# EAGLE design PCB-SSB-4x2 (EAGLE 6.4)
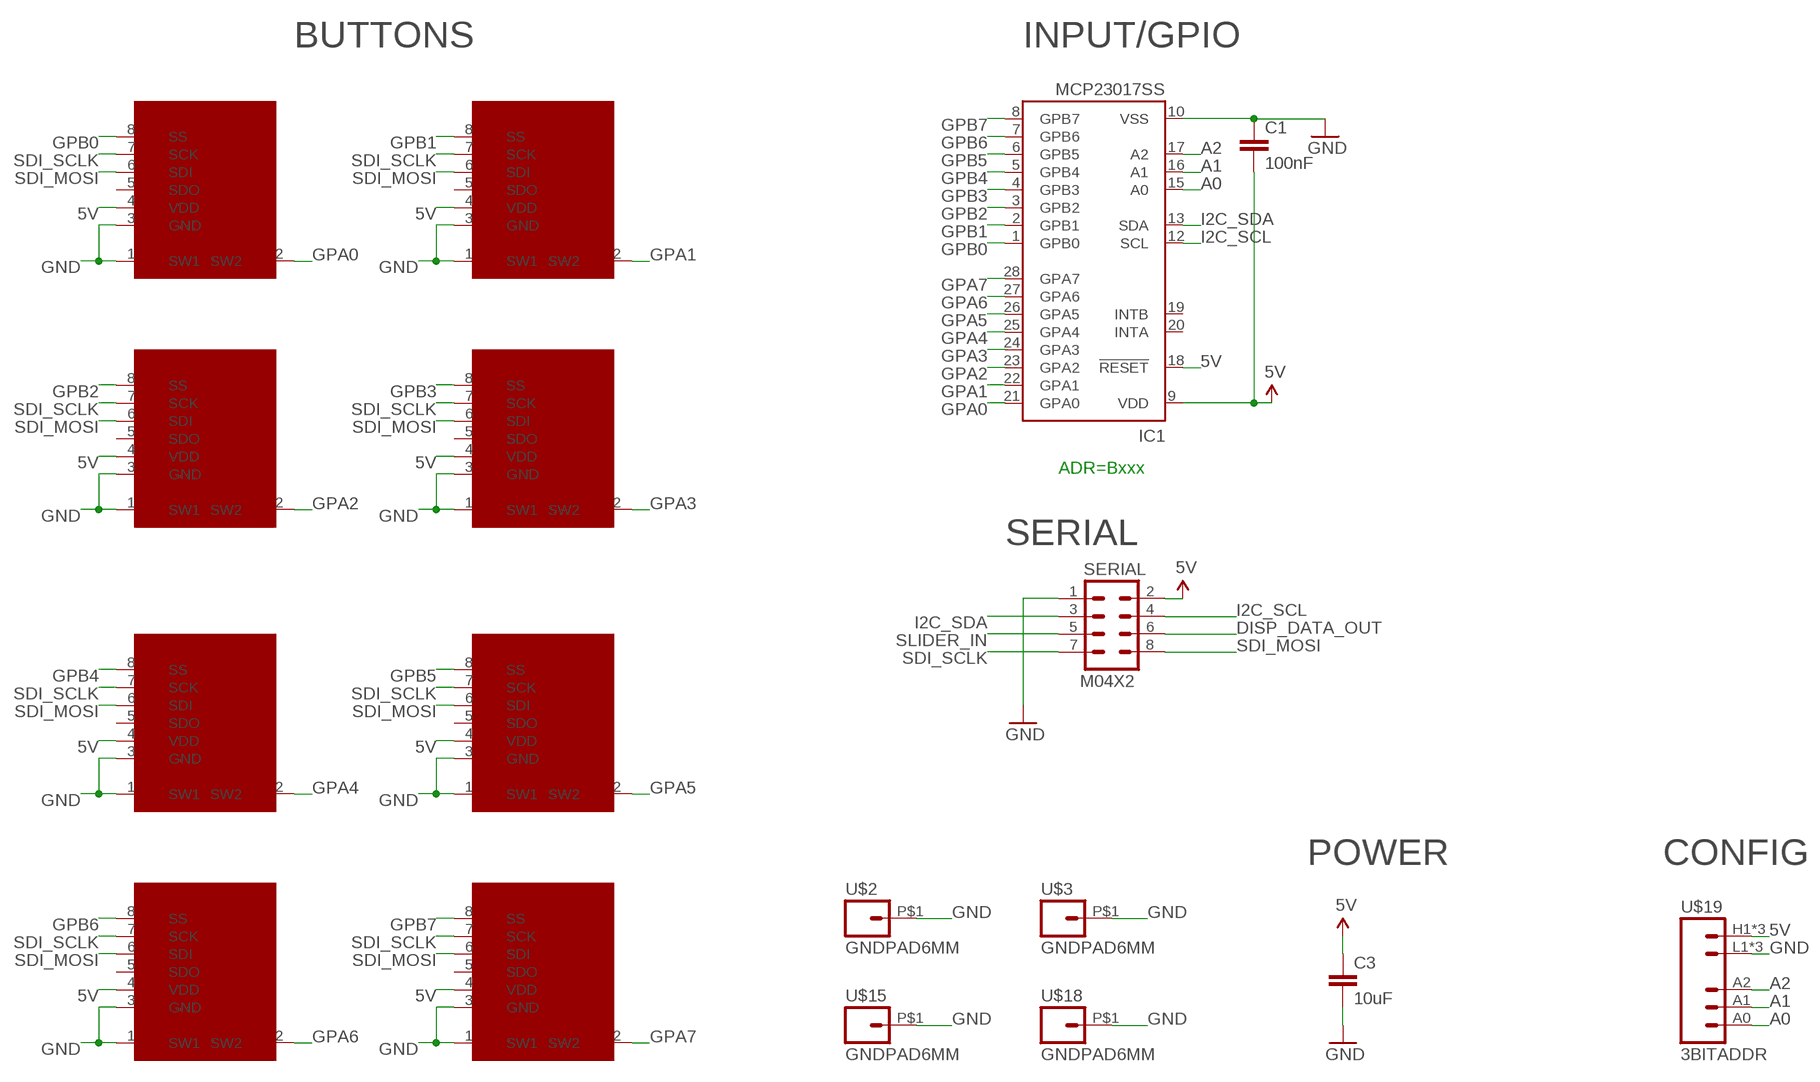
[diagram p0: schematic, sheet 1]

## Parts
C1  100nF  CAP0603-CAP  [0603-CAP]
C3  10uF  CAP0805  [0805]
IC1  MCP23017SS  [SSOP28]
SERIAL  M04X2  [2X4]
SSW1  SMART_SWITCHSMART_SWITCH_8PIN  [SMART_SWITCH]
SSW2  SMART_SWITCHSMART_SWITCH_8PIN  [SMART_SWITCH]
SSW3  SMART_SWITCHSMART_SWITCH_8PIN  [SMART_SWITCH]
SSW4  SMART_SWITCHSMART_SWITCH_8PIN  [SMART_SWITCH]
SSW5  SMART_SWITCHSMART_SWITCH_8PIN  [SMART_SWITCH]
SSW6  SMART_SWITCHSMART_SWITCH_8PIN  [SMART_SWITCH]
SSW7  SMART_SWITCHSMART_SWITCH_8PIN  [SMART_SWITCH]
SSW8  SMART_SWITCHSMART_SWITCH_8PIN  [SMART_SWITCH]
U$2  GNDPAD6MM  [3.2MMPAD6MM]
U$3  GNDPAD6MM  [3.2MMPAD6MM]
U$15  GNDPAD6MM  [3.2MMPAD6MM]
U$18  GNDPAD6MM  [3.2MMPAD6MM]
U$19  3BITADDR  [3BITADDR]

## Nets
5V [Power]: C1.2 C3.1 IC1.9(VDD) IC1.18(!RESET) SERIAL.2 SSW1.4(VDD) SSW2.4(VDD) SSW3.4(VDD) SSW4.4(VDD) SSW5.4(VDD) SSW6.4(VDD) SSW7.4(VDD) SSW8.4(VDD) U$19.H1(VCC) U$19.H2(VCC) U$19.H3(VCC)
A0: IC1.15(A0) U$19.A0
A1: IC1.16(A1) U$19.A1
A2: IC1.17(A2) U$19.A2
DISP_DATA_OUT: SERIAL.6
GND [Power]: C1.1 C3.2 IC1.10(VSS) SERIAL.1 SSW1.1(SW1) SSW1.3(GND) SSW2.1(SW1) SSW2.3(GND) SSW3.1(SW1) SSW3.3(GND) SSW4.1(SW1) SSW4.3(GND) SSW5.1(SW1) SSW5.3(GND) SSW6.1(SW1) SSW6.3(GND) SSW7.1(SW1) SSW7.3(GND) SSW8.1(SW1) SSW8.3(GND) U$2.P$1 U$3.P$1 U$15.P$1 U$18.P$1 U$19.L1(GND) U$19.L2(GND) U$19.L3(GND)
GPA0: IC1.21(GPA0) SSW1.2(SW2)
GPA1: IC1.22(GPA1) SSW2.2(SW2)
GPA2: IC1.23(GPA2) SSW3.2(SW2)
GPA3: IC1.24(GPA3) SSW4.2(SW2)
GPA4: IC1.25(GPA4) SSW5.2(SW2)
GPA5: IC1.26(GPA5) SSW6.2(SW2)
GPA6: IC1.27(GPA6) SSW7.2(SW2)
GPA7: IC1.28(GPA7) SSW8.2(SW2)
GPB0: IC1.1(GPB0) SSW1.8(SS)
GPB1: IC1.2(GPB1) SSW2.8(SS)
GPB2: IC1.3(GPB2) SSW3.8(SS)
GPB3: IC1.4(GPB3) SSW4.8(SS)
GPB4: IC1.5(GPB4) SSW5.8(SS)
GPB5: IC1.6(GPB5) SSW6.8(SS)
GPB6: IC1.7(GPB6) SSW7.8(SS)
GPB7: IC1.8(GPB7) SSW8.8(SS)
I2C_SCL: IC1.12(SCL) SERIAL.4
I2C_SDA: IC1.13(SDA) SERIAL.3
SDI_MOSI: SERIAL.8 SSW1.6(SDI) SSW2.6(SDI) SSW3.6(SDI) SSW4.6(SDI) SSW5.6(SDI) SSW6.6(SDI) SSW7.6(SDI) SSW8.6(SDI)
SDI_SCLK: SERIAL.7 SSW1.7(SCK) SSW2.7(SCK) SSW3.7(SCK) SSW4.7(SCK) SSW5.7(SCK) SSW6.7(SCK) SSW7.7(SCK) SSW8.7(SCK)
SLIDER_IN: SERIAL.5
Unconnected: IC1.19(INTB) IC1.20(INTA) SSW1.5(SDO) SSW2.5(SDO) SSW3.5(SDO) SSW4.5(SDO) SSW5.5(SDO) SSW6.5(SDO) SSW7.5(SDO) SSW8.5(SDO)

## Notes on the sheet
- BUTTONS | INPUT/GPIO
- ADR=Bxxx
- SERIAL
- POWER | CONFIG

## Library data of the parts
C1 C3 = SparkFun:CAP: Capacitor Standard 0603 ceramic capacitor, and 0.1" leaded capacitor.
IC1 = microchip:MCP23017: http://ww1.microchip.com/downloads/en/DeviceDoc/21952a.pdf Source: http://ww1.microchip.com/downloads/en/DeviceDoc/21952a.pdf; MF: MICROCHIP; MPN: MCP23017-E/SS; OC_FARNELL: 1467674; OC_NEWARK: 31K2960
SERIAL = SparkFun:M04X2
SSW1-SSW8 = SKAARHOJ:SMART_SWITCH: SMARTSWITCH IS15DSBFP4RGB www.nkksmartswitch.com
U$2 U$3 U$15 U$18 = SKAARHOJ:GNDPAD
U$19 = SKAARHOJ:3BITADDR

## Net classes
0 default: width 0.203 mm, drill 0.406 mm, clearance 0.203 mm
1 Power: width 0.406 mm, drill 0.61 mm, clearance 0.203 mm

## Board
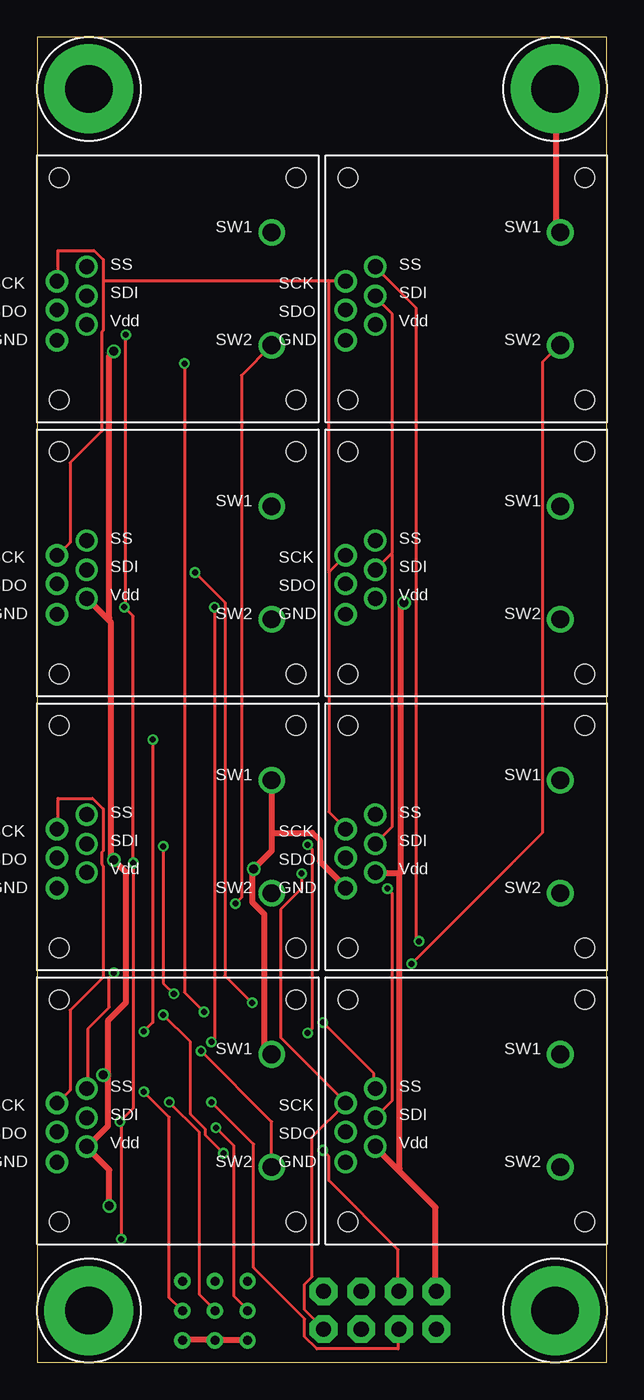
[diagram p1: board, top side]
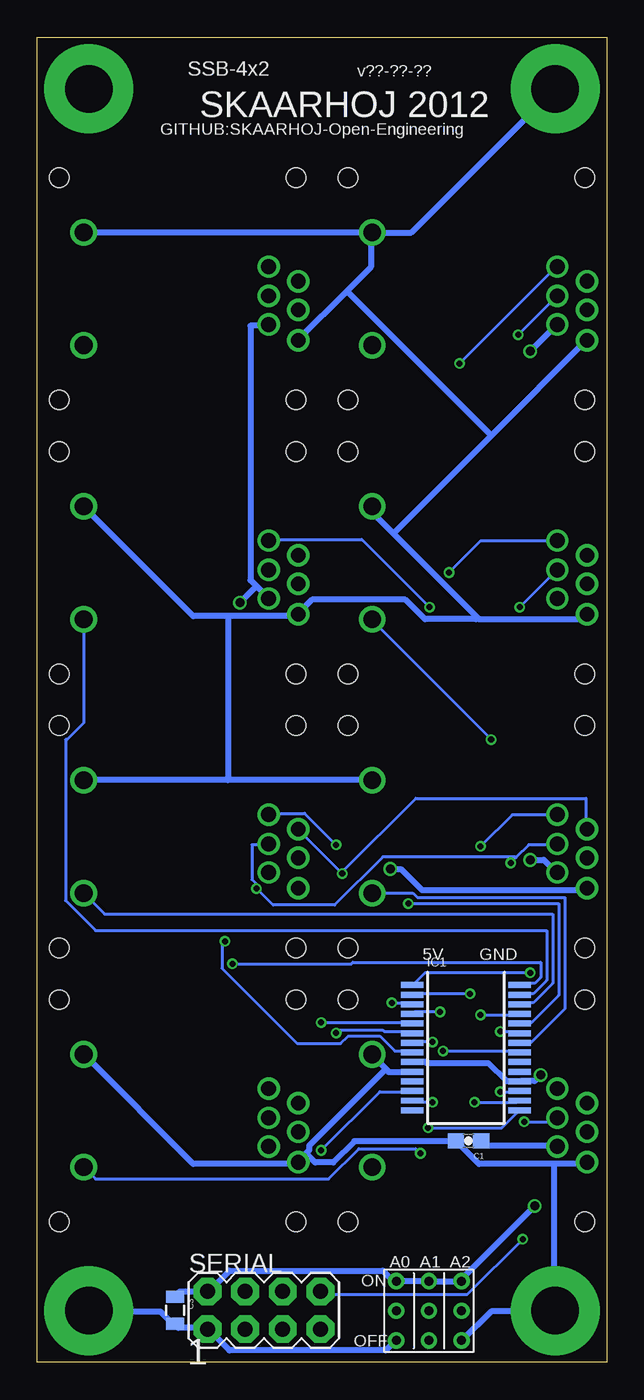
[diagram p2: board, bottom side, seen from below]

Size 38.5 x 89.5 mm. Coordinates in mm from the lower left corner, seen from the top.
Outline: 0,0 38.5,0 38.5,89.5 0,89.5 0,0
Copper layers (1*16): Top 0.035mm / dielectric 1.5mm / Bottom 0.035mm
Design rules "default": minimum track width 6mil, minimum drill 12mil, track to track 6mil, track to pad 6mil, pad to pad 6mil, via to via 6mil, smd to smd 0mil, copper to edge 10mil, drill to drill 10mil, minimum pad ring 10mil, minimum via ring 6mil, stop-mask expansion 2mil, vias tented up to drill 100mil, thermal gap 10mil

### Footprints (pad centres in the part's own frame; a part is rotated, then mirrored left to right if it is on the bottom)
0603-CAP = smd 1.1 x 1: 1 -0.85,0; 2 0.85,0
0805 = smd 0.8 x 1.2: 1 -0.9,0; 2 0.9,0
SSOP28 = smd 0.4 x 1.5: 1 -4.225,-3.625; 2 -3.575,-3.625; 3 -2.925,-3.625; 4 -2.275,-3.625; 5 -1.625,-3.625; 6 -0.975,-3.625; 7 -0.325,-3.625; 8 0.325,-3.625; 9 0.975,-3.625; 10 1.625,-3.625; 11 2.275,-3.625; 12 2.925,-3.625; 13 3.575,-3.625; 14 4.225,-3.625; 15 4.225,3.625; 16 3.575,3.625; 17 2.925,3.625; 18 2.275,3.625; 19 1.625,3.625; 20 0.975,3.625; 21 0.325,3.625; 22 -0.325,3.625; 23 -0.975,3.625; 24 -1.625,3.625; 25 -2.275,3.625; 26 -2.925,3.625; 27 -3.575,3.625; 28 -4.225,3.625
2X4 = drill 1.016 pad 1.88 octagon: 1 -3.81,-1.27; 2 -3.81,1.27; 3 -1.27,-1.27; 4 -1.27,1.27; 5 1.27,-1.27; 6 1.27,1.27; 7 3.81,-1.27; 8 3.81,1.27
SMART_SWITCH = drill 1.2: 1 6.35,3.81; 2 6.35,-3.81 | drill 1: 3 -8.153,-3.48; 4 -6.147,-2.413; 5 -8.153,-1.422; 6 -6.147,-0.483; 7 -8.153,0.508; 8 -6.147,1.499 | hole 1.3: -8.001,7.506; 8.001,7.506; 8.001,-7.506; -8.001,-7.506
3.2MMPAD6MM = drill 3.2 pad 6: P$1 0,0
3BITADDR = drill 0.6: A0 -2.2,0; A1 0,0; A2 2.2,0; H1 -2.2,2; H2 0,2; H3 2.2,2; L1 -2.2,-2; L2 0,-2; L3 2.2,-2

### Placement (x,y rotation side)
C1  9.35,14.96 0 bottom
C3  29.16,3.52 270 bottom
IC1  9.53,21.26 270 bottom
SERIAL  23.17,3.52 0 bottom
SSW1  9.5,17 0 top
SSW2  9.5,35.5 0 top
SSW3  9.5,54 0 top
SSW4  9.5,72.5 0 top
SSW5  29,17 0 top
SSW6  29,35.5 0 top
SSW7  29,54 0 top
SSW8  29,72.5 0 top
U$2  3.5,3.5 0 top
U$3  3.5,86 0 top
U$15  35,3.5 0 top
U$18  35,86 0 top
U$19  12.03,3.49 0 bottom

### Tracks (layer width: path | path; a pad name or v marks a point on that pad's centre or on a via)
5V  (via drill 0.61)
  Top 0.406: 4.78,50.19 3.45,51.51 SSW3.4 | 4.78,50.19 4.98,49.99 4.98,34.14 v5.18,33.93 5.99,33.12 5.99,24.28 4.78,23.06 4.78,19.41 | v5.18,68.28 4.88,67.97 4.88,50.29 4.78,50.19 | 4.78,19.41 4.78,15.95 3.45,14.63 SSW1.4 3.45,14.43 4.88,13.01 v4.88,10.57 | 4.78,19.41 v4.47,19.41 | 24.38,13.01 26.92,10.46 26.92,4.88 SERIAL.2 | 24.38,13.01 22.86,14.53 SSW5.4 | 24.49,33.02 22.86,33.02 SSW6.4 | 24.49,33.02 24.49,13.11 24.38,13.01 | v24.79,51.31 24.59,51.1 24.59,33.12 24.49,33.02
  Bottom 0.406: IC1.9 13.11,20.32 12.29,20.32 12.19,20.22 8.03,20.22 6.81,19 5.99,19 IC1.18 5.79,19 4.88,19 v4.47,19.41 | C1.2 8.43,14.94 8.13,14.63 3.45,14.63 SSW1.4 | v5.18,33.93 4.27,33.93 3.45,33.12 SSW2.4 | v5.18,68.28 3.45,70 SSW4.4 | 23.67,52.43 24.08,52.83 24.08,70 22.86,70 SSW8.4 | 23.67,52.43 22.86,51.61 SSW7.4 | C3.1 29.16,4.47 28.85,4.78 27.03,4.78 SERIAL.2 26.82,4.88 25.5,6.2 15.14,6.2 14.43,5.49 U$19.H1 12.19,5.49 U$19.H2 11.99,5.49 9.86,5.49 U$19.H3 9.75,5.69 v4.88,10.57 | v24.79,51.31 23.67,52.43
A0  (via drill 0.41)
  Top 0.203: v12.09,15.85 13.31,14.63 13.31,4.47 14.22,3.56 U$19.A0
  Bottom 0.203: v12.09,15.85 7.11,15.85 5.99,16.97 IC1.15
A1  (via drill 0.41)
  Top 0.203: v8.94,17.58 10.97,15.54 10.97,4.57 11.99,3.56 U$19.A1
  Bottom 0.203: v8.94,17.58 6.1,17.58 5.99,17.68 IC1.16
A2  (via drill 0.41)
  Top 0.203: v7.21,18.29 8.94,16.56 8.94,4.37 9.75,3.56 U$19.A2
  Bottom 0.203: v7.21,18.29 5.99,18.29 IC1.17
GND  (via drill 0.61)
  Top 0.406: U$19.L3 9.86,1.52 11.99,1.52 U$19.L2 12.19,1.52 14.22,1.52 U$19.L1 | 15.85,35.76 15.85,39.22 SSW2.1 | 15.85,35.76 15.85,34.54 v14.63,33.33 14.53,33.22 14.53,31.09 15.34,30.28 15.34,21.34 15.85,20.83 SSW1.1 | 15.85,35.76 18.59,35.76 19.1,35.26 19.1,33.83 20.83,32.11 SSW6.3 | SSW8.1 35.26,76.4 35.05,76.61 35.05,85.95 U$18.P$1
  Bottom 0.406: 14.94,19.81 15.85,20.73 SSW1.1 | 14.94,19.81 14.73,19.61 13.21,19.61 IC1.10 | 20.32,14.12 20.12,14.33 20.12,14.63 14.94,19.81 | 20.32,14.12 20.83,13.61 SSW5.3 20.93,13.41 27.94,13.41 35.26,20.73 SSW5.1 | U$15.P$1 34.95,3.45 30.18,3.45 29.36,2.64 C3.2 29.16,2.54 28.96,2.34 27.03,2.34 SERIAL.1 26.82,2.13 25.5,0.81 14.94,0.81 14.33,1.42 U$19.L1 | 3.56,13.41 1.52,13.41 1.42,13.51 SSW1.3 | 3.56,13.41 8.64,13.41 10.16,14.94 C1.1 10.36,14.94 17.07,14.94 18.49,13.51 19.71,13.51 20.32,14.12 | U$19.L3 9.75,1.52 7.82,3.45 3.56,3.45 U$2.P$1 3.56,3.66 3.56,13.41 | v14.63,33.33 13.92,33.33 12.5,31.9 1.52,31.9 1.42,32 SSW2.3 | 25.6,39.32 15.95,39.32 SSW2.1 | 25.6,39.32 35.26,39.32 SSW6.1 | 17.58,72.34 15.95,73.97 15.95,76.3 SSW4.1 | 17.58,72.34 20.83,69.09 SSW8.3 | 14.43,55.98 15.85,57.4 15.85,57.71 SSW3.1 | 14.43,55.98 8.74,50.29 | 8.74,50.29 8.64,50.19 1.73,50.19 1.42,50.49 SSW3.3 | 8.74,50.29 8.84,50.19 12.29,50.19 13.61,51.51 19.91,51.51 20.83,50.6 SSW7.3 20.93,50.39 25.6,50.39 | 14.43,55.98 7.82,62.59 | 7.82,62.59 1.42,68.99 SSW4.3 | 25.6,50.39 27.94,50.39 35.26,57.71 SSW7.1 | 7.82,62.59 17.58,72.34 | U$3.P$1 3.56,85.95 13.21,76.3 15.65,76.3 SSW4.1 | SSW8.1 35.26,76.3 16.15,76.3 SSW4.1 | 25.6,50.39 25.6,39.32
GPA0  (via drill 0.41)
  Top 0.203: v11.07,21.03 15.85,16.26 15.85,13.21 SSW1.2
  Bottom 0.203: v11.07,21.03 5.99,21.03 IC1.21
GPA1
  Bottom 0.203: IC1.22 5.89,21.64 5.08,21.64 2.85,23.88 2.85,31.39 12.8,31.39 13.11,31.7 SSW2.2
GPA2  (via drill 0.41)
  Top 0.203: v7.21,22.35 7.82,22.96 v7.82,42.06
  Bottom 0.203: v7.21,22.35 6.1,22.35 5.99,22.25 IC1.23 | v7.82,42.06 15.85,50.09 SSW3.2
GPA3  (via drill 0.41)
  Top 0.203: v13.41,30.99 13.82,31.39 13.82,66.65 SSW4.2
  Bottom 0.203: v13.41,30.99 3.25,30.99 3.25,24.79 5.08,22.96 5.89,22.96 IC1.24
GPA4  (via drill 0.41)
  Top 0.203: v8.53,23.47 10.36,21.64 10.36,16.76 11.38,15.75 11.38,15.34 v12.6,14.12
  Bottom 0.203: v8.53,23.47 5.99,23.47 IC1.25 | v12.6,14.12 12.9,14.43 16.76,14.43 18.8,12.39 34.54,12.39 35.26,13.11 SSW5.2
GPA5
  Bottom 0.203: IC1.26 5.89,24.28 4.98,24.28 3.66,25.6 3.66,30.28 33.93,30.28 35.26,31.6 SSW6.2
GPA6
  Bottom 0.203: IC1.27 5.89,24.89 4.98,24.89 4.06,25.81 4.06,29.16 34.54,29.16 36.58,31.19 36.58,42.06 36.47,42.06 35.36,43.18 35.36,50.09 SSW7.2
GPA7  (via drill 0.41)
  Top 0.203: v25.3,26.92 34.14,35.76 34.14,67.56 35.26,68.68 SSW8.2
  Bottom 0.203: v25.3,26.92 17.27,26.92 17.17,27.03 4.47,27.03 4.47,26.01 4.88,25.6 5.79,25.6 5.89,25.5 IC1.28
GPB0  (via drill 0.41)
  Top 0.203: v5.18,26.31 4.88,26.01 4.88,23.98 3.45,22.55 3.45,18.59 SSW1.8
  Bottom 0.203: v5.18,26.31 12.29,26.31 13.11,25.5 IC1.1
GPB1  (via drill 0.41)
  Top 0.203: v9.25,24.89 8.53,25.6 v8.53,34.85
  Bottom 0.203: v9.25,24.89 13.11,24.89 IC1.2 | v8.53,34.85 6.4,36.98 3.45,36.98 SSW2.8
GPB2  (via drill 0.41)
  Top 0.203: v14.53,24.28 12.7,26.11 12.7,51.31 v10.67,53.34
  Bottom 0.203: v14.53,24.28 13.21,24.28 IC1.3 | v10.67,53.34 8.53,55.47 3.45,55.47 SSW3.8
GPB3  (via drill 0.41)
  Top 0.203: v11.28,23.67 9.96,24.99 v9.96,67.46
  Bottom 0.203: v11.28,23.67 13.01,23.67 13.11,23.57 IC1.4 | v9.96,67.46 3.45,73.97 SSW4.8
GPB4  (via drill 0.41)
  Top 0.203: v19.3,22.96 22.76,19.51 22.76,18.59 SSW5.8
  Bottom 0.203: v19.3,22.96 13.21,22.96 IC1.5
GPB5  (via drill 0.41)
  Top 0.203: v18.29,22.25 18.59,22.55 18.59,34.65 v18.29,34.95
  Bottom 0.203: v18.29,22.25 18.09,22.45 15.14,22.45 15.04,22.35 13.31,22.35 13.21,22.25 IC1.6 | v18.29,34.95 20.42,37.08 22.76,37.08 SSW6.8
GPB6  (via drill 0.41)
  Top 0.203: v11.79,21.64 11.99,21.84 v11.99,51
  Bottom 0.203: v11.79,21.64 13.11,21.64 IC1.7 | v11.99,51 16.56,55.58 22.76,55.58 SSW7.8
GPB7  (via drill 0.41)
  Top 0.203: v25.81,28.45 25.6,28.65 25.6,71.22 22.86,73.97 SSW8.8
  Bottom 0.203: v25.81,28.45 26.01,28.45 26.01,26.62 20.93,21.54 17.98,21.54 17.48,22.05 15.34,22.05 14.33,21.03 13.21,21.03 IC1.8
I2C_SCL  (via drill 0.41)
  Top 0.203: v19.3,14.33 19.71,13.92 19.71,12.29 24.38,7.62 24.38,4.88 SERIAL.4
  Bottom 0.203: v19.3,14.33 15.34,18.29 13.21,18.29 IC1.12
I2C_SDA  (via drill 0.41)
  Top 0.203: v11.79,17.58 14.63,14.73 14.63,6.4 18.09,2.95 18.09,1.73 18.9,0.91 24.38,0.91 24.38,2.23 SERIAL.3
  Bottom 0.203: v11.79,17.58 13.01,17.58 13.11,17.68 IC1.13
SDI_MOSI  (via drill 0.41)
  Top 0.203: v23.67,32 23.98,31.7 23.98,17.68 22.86,16.56 SSW5.6 | 23.93,54.61 23.98,54.66 23.98,70.81 22.86,71.93 SSW8.6 | 23.93,54.61 22.86,53.54 SSW7.6 | SSW6.6 22.86,35.05 23.98,36.17 23.98,54.56 23.93,54.61 | v5.99,69.39 5.99,51 v5.89,51 6.5,50.39 v6.5,33.73 6.5,17.17 v5.59,16.26 5.69,16.26 v5.69,8.33
  Bottom 0.203: SSW6.6 22.86,34.95 23.98,34.95 23.98,32.61 23.67,32.31 v23.67,32 22.55,30.89 18.39,30.89 15.14,34.14 6.2,34.14 6.15,34.09 | v5.59,16.26 3.66,16.26 3.45,16.46 SSW1.6 | 6.15,34.09 5.28,34.95 3.45,34.95 SSW2.6 | 6.15,34.09 v6.5,33.73 | v5.89,51 3.45,53.44 SSW3.6 | v5.99,69.39 3.45,71.93 SSW4.6 | v5.69,8.33 9.45,4.57 19.1,4.57 19.3,4.78 SERIAL.8
SDI_SCLK  (via drill 0.41)
  Top 0.203: 4.47,73.05 4.47,74.47 3.86,75.08 1.42,75.08 1.42,73.05 SSW4.7 | 4.47,73.05 4.47,69.7 4.37,69.6 4.37,62.89 2.23,60.76 2.23,55.37 1.42,54.56 SSW3.7 | 4.47,73.05 19.71,73.05 | 19.71,73.05 20.83,73.05 SSW8.7 | SSW1.7 1.42,17.58 2.23,18.39 2.23,23.77 4.47,26.01 4.47,33.53 4.37,33.63 4.37,34.44 4.47,34.54 4.47,37.39 3.76,38.1 1.42,38.1 1.42,36.07 SSW2.7 | SERIAL.7 19.3,2.34 18.09,3.56 18.09,5.28 18.59,5.79 18.59,15.24 20.83,17.48 SSW5.7 20.83,17.58 16.46,21.95 16.46,30.58 17.88,32 v17.88,33.02 | 19.76,53.39 20.83,54.46 SSW7.7 | 19.76,53.39 19.71,53.34 19.71,37.19 20.83,36.07 SSW6.7 | 19.71,73.05 19.71,53.44 19.76,53.39
  Bottom 0.203: SSW6.7 20.83,35.97 v17.88,33.02 17.88,33.12 12.9,38.1 1.42,38.1 1.42,36.07 SSW2.7

### Text on the board
_bsilk: v??-??-?? | SSB-4x2 | SKAARHOJ 2012 | GITHUB:SKAARHOJ-Open-Engineering | GND | 5V | 1